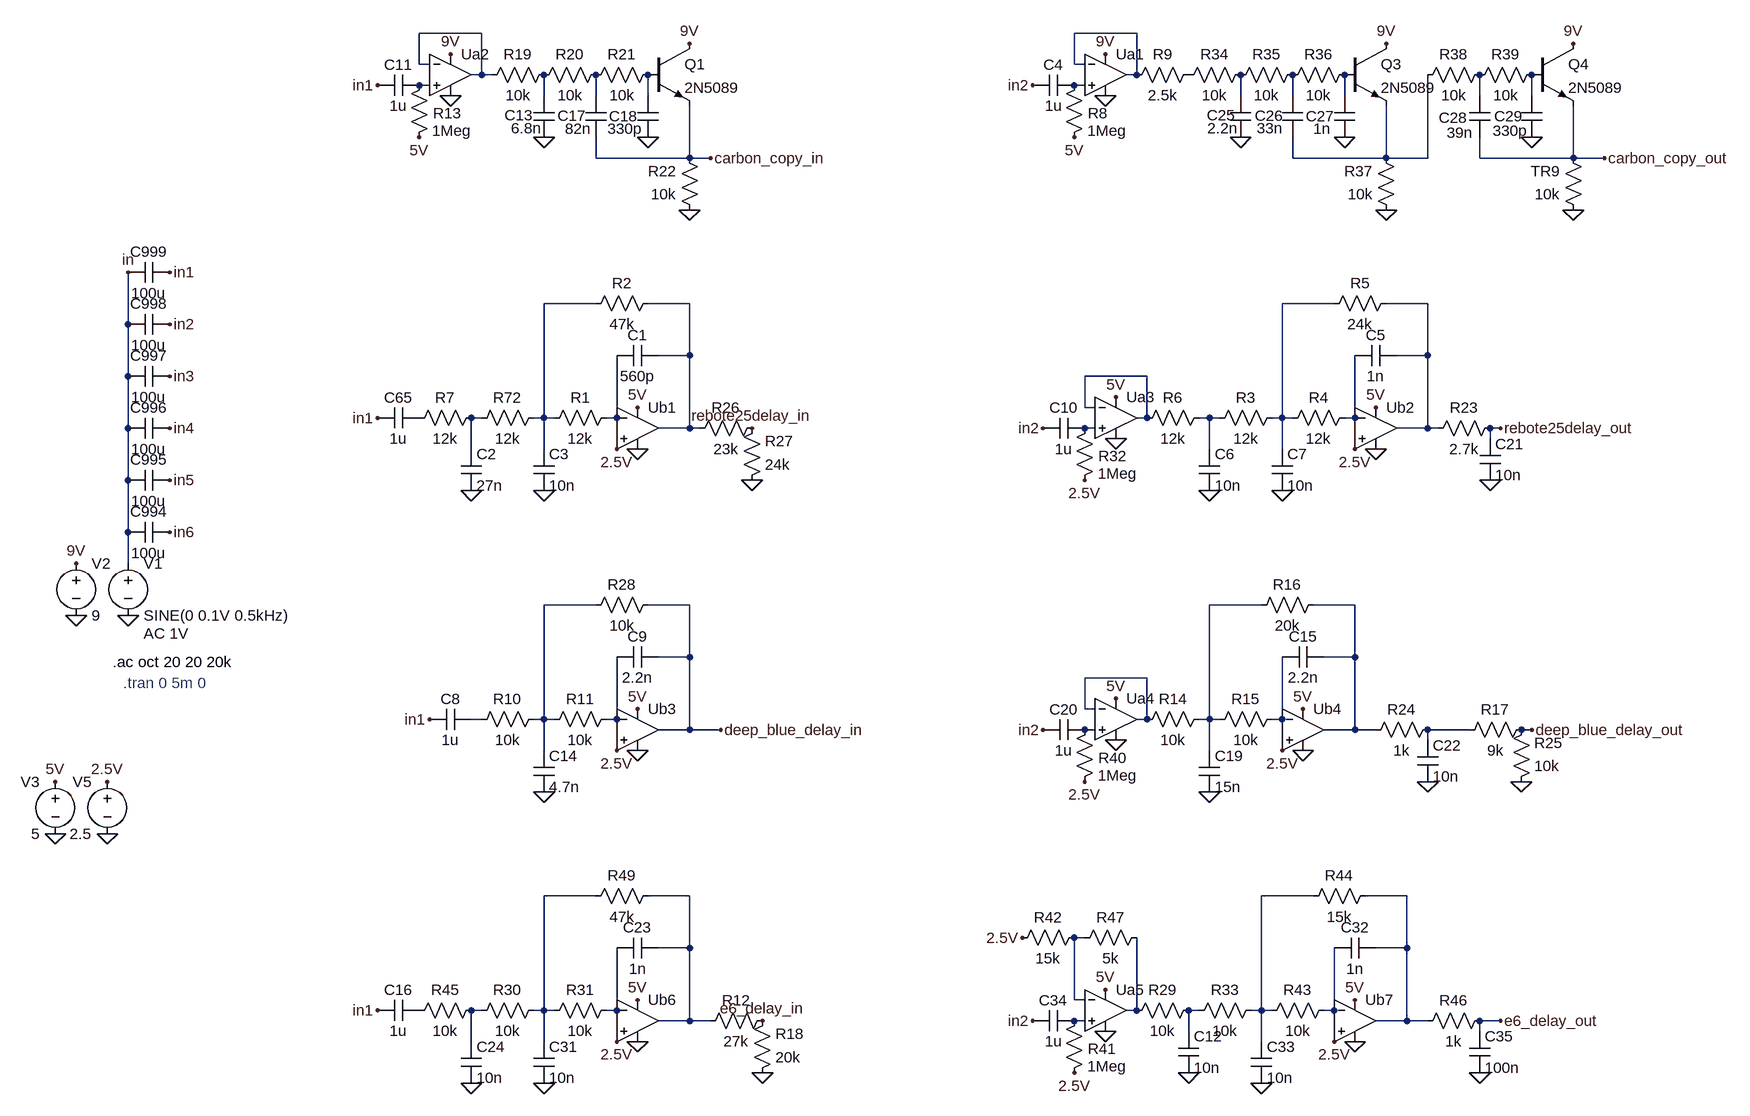
[diagram p0: schematic PT2399_LPF.asc]
PT2399_LPF.asc, the LTspice schematic file:
Version 4
SHEET 1 4500 3732
WIRE -240 272 -336 272
WIRE 768 272 672 272
WIRE -336 320 -336 272
WIRE -320 320 -336 320
WIRE 672 320 672 272
WIRE 688 320 672 320
WIRE -240 336 -240 272
WIRE -240 336 -256 336
WIRE -224 336 -240 336
WIRE 768 336 768 272
WIRE 768 336 752 336
WIRE -320 352 -336 352
WIRE 688 352 672 352
WIRE -144 368 -144 336
WIRE -64 368 -64 336
WIRE 16 368 16 336
WIRE 928 368 928 336
WIRE 1008 368 1008 336
WIRE 1088 368 1088 336
WIRE 1296 368 1296 336
WIRE 1376 368 1376 336
WIRE -64 464 -64 432
WIRE 80 464 80 384
WIRE 80 464 -64 464
WIRE 112 464 80 464
WIRE 1008 464 1008 432
WIRE 1152 464 1152 384
WIRE 1152 464 1008 464
WIRE 1216 464 1216 336
WIRE 1216 464 1152 464
WIRE 1296 464 1296 432
WIRE 1440 464 1440 384
WIRE 1440 464 1296 464
WIRE 1488 464 1440 464
WIRE -64 688 -144 688
WIRE 80 688 16 688
WIRE 1072 688 992 688
WIRE 1216 688 1152 688
WIRE -784 720 -784 640
WIRE 80 768 80 688
WIRE 80 768 32 768
WIRE 1216 768 1216 688
WIRE 1216 768 1168 768
WIRE -784 800 -784 720
WIRE 784 800 688 800
WIRE 688 848 688 800
WIRE 704 848 688 848
WIRE -240 864 -256 864
WIRE -144 864 -144 688
WIRE -144 864 -160 864
WIRE -128 864 -144 864
WIRE -32 864 -32 768
WIRE -32 864 -48 864
WIRE 784 864 784 800
WIRE 784 864 768 864
WIRE 880 864 864 864
WIRE 896 864 880 864
WIRE 992 864 992 688
WIRE 992 864 976 864
WIRE 1008 864 992 864
WIRE 1104 864 1104 768
WIRE 1104 864 1088 864
WIRE -784 880 -784 800
WIRE 80 880 80 768
WIRE 80 880 32 880
WIRE 96 880 80 880
WIRE 704 880 688 880
WIRE 1216 880 1216 768
WIRE 1216 880 1168 880
WIRE 1232 880 1216 880
WIRE 1328 880 1312 880
WIRE 1312 896 1312 880
WIRE -256 912 -256 864
WIRE -144 912 -144 864
WIRE -32 912 -32 896
WIRE 880 912 880 864
WIRE 992 912 992 864
WIRE 1104 912 1104 896
WIRE -784 960 -784 880
WIRE -784 1040 -784 960
WIRE -784 1088 -784 1040
WIRE -64 1152 -144 1152
WIRE 80 1152 16 1152
WIRE 960 1152 880 1152
WIRE 1104 1152 1040 1152
WIRE 80 1232 80 1152
WIRE 80 1232 32 1232
WIRE 1104 1232 1104 1152
WIRE 1104 1232 1056 1232
WIRE 784 1264 688 1264
WIRE 688 1312 688 1264
WIRE 704 1312 688 1312
WIRE -240 1328 -256 1328
WIRE -144 1328 -144 1152
WIRE -144 1328 -160 1328
WIRE -128 1328 -144 1328
WIRE -32 1328 -32 1232
WIRE -32 1328 -48 1328
WIRE 784 1328 784 1264
WIRE 784 1328 768 1328
WIRE 880 1328 880 1152
WIRE 880 1328 864 1328
WIRE 896 1328 880 1328
WIRE 992 1328 992 1232
WIRE 992 1328 976 1328
WIRE 80 1344 80 1232
WIRE 80 1344 32 1344
WIRE 128 1344 80 1344
WIRE 704 1344 688 1344
WIRE 1104 1344 1104 1232
WIRE 1104 1344 1056 1344
WIRE 1136 1344 1104 1344
WIRE 1280 1344 1216 1344
WIRE 1376 1344 1360 1344
WIRE 1216 1360 1216 1344
WIRE -144 1376 -144 1328
WIRE -32 1376 -32 1360
WIRE 880 1376 880 1328
WIRE 992 1376 992 1360
WIRE -64 1600 -144 1600
WIRE 80 1600 16 1600
WIRE 1040 1600 960 1600
WIRE 1184 1600 1120 1600
WIRE 688 1664 672 1664
WIRE 80 1680 80 1600
WIRE 80 1680 32 1680
WIRE 1184 1680 1184 1600
WIRE 1184 1680 1136 1680
WIRE 672 1760 672 1664
WIRE 688 1760 672 1760
WIRE -240 1776 -256 1776
WIRE -144 1776 -144 1600
WIRE -144 1776 -160 1776
WIRE -128 1776 -144 1776
WIRE -32 1776 -32 1680
WIRE -32 1776 -48 1776
WIRE 768 1776 768 1664
WIRE 768 1776 752 1776
WIRE 864 1776 848 1776
WIRE 960 1776 960 1600
WIRE 960 1776 944 1776
WIRE 976 1776 960 1776
WIRE 1072 1776 1072 1680
WIRE 1072 1776 1056 1776
WIRE 80 1792 80 1680
WIRE 80 1792 32 1792
WIRE 112 1792 80 1792
WIRE 688 1792 672 1792
WIRE 1184 1792 1184 1680
WIRE 1184 1792 1136 1792
WIRE 1216 1792 1184 1792
WIRE 1328 1792 1296 1792
WIRE 848 1808 848 1776
WIRE 1296 1808 1296 1792
WIRE -256 1824 -256 1776
WIRE -144 1824 -144 1776
WIRE -32 1824 -32 1808
WIRE 960 1824 960 1776
WIRE 1072 1824 1072 1808
FLAG -784 1168 0
FLAG -784 640 in
FLAG -864 1168 0
FLAG -864 1088 9V
FLAG -720 640 in1
FLAG -720 720 in2
FLAG -720 800 in3
FLAG -720 880 in4
FLAG -720 960 in5
FLAG -720 1040 in6
FLAG -400 864 in1
FLAG -816 1424 2.5V
FLAG -896 1504 0
FLAG -896 1424 5V
FLAG 0 848 5V
FLAG 0 912 0
FLAG -32 912 2.5V
FLAG -144 976 0
FLAG -256 976 0
FLAG 176 880 rebote25delay_in
FLAG 1136 848 5V
FLAG 1136 912 0
FLAG 1104 912 2.5V
FLAG 992 976 0
FLAG 880 976 0
FLAG 1152 288 9V
FLAG 1088 432 0
FLAG 928 432 0
FLAG 1152 544 0
FLAG 1440 288 9V
FLAG 1376 432 0
FLAG 1440 544 0
FLAG 1488 464 carbon_copy_out
FLAG -400 352 in1
FLAG 80 288 9V
FLAG 16 432 0
FLAG -144 432 0
FLAG 80 544 0
FLAG 112 464 carbon_copy_in
FLAG -288 304 9V
FLAG -288 368 0
FLAG -336 432 5V
FLAG 608 352 in2
FLAG 720 304 9V
FLAG 720 368 0
FLAG 672 432 5V
FLAG -320 1328 in1
FLAG 0 1312 5V
FLAG 0 1376 0
FLAG -32 1376 2.5V
FLAG -144 1440 0
FLAG 128 1344 deep_blue_delay_in
FLAG 1024 1312 5V
FLAG 1024 1376 0
FLAG 992 1376 2.5V
FLAG 880 1440 0
FLAG 1312 960 0
FLAG 1216 1424 0
FLAG 176 960 0
FLAG -400 1776 in1
FLAG 0 1760 5V
FLAG 0 1824 0
FLAG -32 1824 2.5V
FLAG -144 1888 0
FLAG -256 1888 0
FLAG 192 1792 e6_delay_in
FLAG 1104 1760 5V
FLAG 1104 1824 0
FLAG 1072 1824 2.5V
FLAG 960 1888 0
FLAG 1296 1872 0
FLAG 192 1872 0
FLAG 848 1872 0
FLAG -816 1504 0
FLAG 1328 880 rebote25delay_out
FLAG 1376 1344 deep_blue_delay_out
FLAG 1328 1792 e6_delay_out
FLAG 624 880 in2
FLAG 736 896 0
FLAG 736 832 5V
FLAG 688 960 2.5V
FLAG 624 1344 in2
FLAG 736 1360 0
FLAG 736 1296 5V
FLAG 688 1424 2.5V
FLAG 608 1792 in2
FLAG 720 1808 0
FLAG 720 1744 5V
FLAG 672 1872 2.5V
FLAG 1360 1424 0
FLAG 592 1664 2.5V
SYMBOL voltage -784 1072 R0
WINDOW 123 24 124 Left 2
WINDOW 39 0 0 Left 2
SYMATTR Value2 AC 1V
SYMATTR InstName V1
SYMATTR Value SINE(0 0.1V 0.5kHz)
SYMBOL voltage -864 1072 R0
WINDOW 123 0 0 Left 0
WINDOW 39 0 0 Left 0
SYMATTR InstName V2
SYMATTR Value 9
SYMBOL cap -720 704 R90
WINDOW 0 0 32 VBottom 2
WINDOW 3 32 32 VTop 2
SYMATTR InstName C998
SYMATTR Value 100u
SYMBOL cap -720 784 R90
WINDOW 0 0 32 VBottom 2
WINDOW 3 32 32 VTop 2
SYMATTR InstName C997
SYMATTR Value 100u
SYMBOL cap -720 864 R90
WINDOW 0 0 32 VBottom 2
WINDOW 3 32 32 VTop 2
SYMATTR InstName C996
SYMATTR Value 100u
SYMBOL cap -720 624 R90
WINDOW 0 0 32 VBottom 2
WINDOW 3 32 32 VTop 2
SYMATTR InstName C999
SYMATTR Value 100u
SYMBOL cap -720 944 R90
WINDOW 0 0 32 VBottom 2
WINDOW 3 32 32 VTop 2
SYMATTR InstName C995
SYMATTR Value 100u
SYMBOL cap -720 1024 R90
WINDOW 0 0 32 VBottom 2
WINDOW 3 32 32 VTop 2
SYMATTR InstName C994
SYMATTR Value 100u
SYMBOL cap -336 848 R90
WINDOW 0 0 32 VBottom 2
WINDOW 3 32 32 VTop 2
SYMATTR InstName C65
SYMATTR Value 1u
SYMBOL voltage -896 1408 M0
WINDOW 123 0 0 Left 0
WINDOW 39 0 0 Left 0
SYMATTR InstName V3
SYMATTR Value 5
SYMBOL res -144 848 R90
WINDOW 0 0 56 VBottom 2
WINDOW 3 32 56 VTop 2
SYMATTR InstName R72
SYMATTR Value 12k
SYMBOL res -32 848 R90
WINDOW 0 0 56 VBottom 2
WINDOW 3 32 56 VTop 2
SYMATTR InstName R1
SYMATTR Value 12k
SYMBOL Opamps\\UniversalOpamp2 0 880 R0
SYMATTR InstName Ub1
SYMBOL res 32 672 R90
WINDOW 0 0 56 VBottom 2
WINDOW 3 32 56 VTop 2
SYMATTR InstName R2
SYMATTR Value 47k
SYMBOL cap 32 752 R90
WINDOW 0 0 32 VBottom 2
WINDOW 3 32 32 VTop 2
SYMATTR InstName C1
SYMATTR Value 560p
SYMBOL cap -272 976 M180
WINDOW 0 24 56 Left 2
WINDOW 3 24 8 Left 2
SYMATTR InstName C2
SYMATTR Value 27n
SYMBOL cap -160 976 M180
WINDOW 0 24 56 Left 2
WINDOW 3 24 8 Left 2
SYMATTR InstName C3
SYMATTR Value 10n
SYMBOL res 992 848 R90
WINDOW 0 0 56 VBottom 2
WINDOW 3 32 56 VTop 2
SYMATTR InstName R3
SYMATTR Value 12k
SYMBOL res 1104 848 R90
WINDOW 0 0 56 VBottom 2
WINDOW 3 32 56 VTop 2
SYMATTR InstName R4
SYMATTR Value 12k
SYMBOL Opamps\\UniversalOpamp2 1136 880 R0
SYMATTR InstName Ub2
SYMBOL res 1168 672 R90
WINDOW 0 0 56 VBottom 2
WINDOW 3 32 56 VTop 2
SYMATTR InstName R5
SYMATTR Value 24k
SYMBOL cap 1168 752 R90
WINDOW 0 0 32 VBottom 2
WINDOW 3 32 32 VTop 2
SYMATTR InstName C5
SYMATTR Value 1n
SYMBOL cap 864 976 M180
WINDOW 0 24 56 Left 2
WINDOW 3 24 8 Left 2
SYMATTR InstName C6
SYMATTR Value 10n
SYMBOL cap 976 976 M180
WINDOW 0 24 56 Left 2
WINDOW 3 24 8 Left 2
SYMATTR InstName C7
SYMATTR Value 10n
SYMBOL res 880 848 R90
WINDOW 0 0 56 VBottom 2
WINDOW 3 32 56 VTop 2
SYMATTR InstName R6
SYMATTR Value 12k
SYMBOL res -240 848 R90
WINDOW 0 0 56 VBottom 2
WINDOW 3 32 56 VTop 2
SYMATTR InstName R7
SYMATTR Value 12k
SYMBOL res 944 320 R90
WINDOW 0 0 56 VBottom 2
WINDOW 3 32 56 VTop 2
SYMATTR InstName R34
SYMATTR Value 10k
SYMBOL cap 912 432 M180
WINDOW 0 -36 34 Left 2
WINDOW 3 -35 14 Left 2
SYMATTR InstName C25
SYMATTR Value 2.2n
SYMBOL res 1024 320 R90
WINDOW 0 0 56 VBottom 2
WINDOW 3 32 56 VTop 2
SYMATTR InstName R35
SYMATTR Value 10k
SYMBOL cap 992 432 M180
WINDOW 0 -42 33 Left 2
WINDOW 3 -39 14 Left 2
SYMATTR InstName C26
SYMATTR Value 33n
SYMBOL res 1104 320 R90
WINDOW 0 0 56 VBottom 2
WINDOW 3 32 56 VTop 2
SYMATTR InstName R36
SYMATTR Value 10k
SYMBOL cap 1072 432 M180
WINDOW 0 -44 32 Left 2
WINDOW 3 -32 13 Left 2
SYMATTR InstName C27
SYMATTR Value 1n
SYMBOL npn 1088 288 R0
SYMATTR InstName Q3
SYMATTR Value 2N5089
SYMBOL res 1168 560 R180
WINDOW 0 36 76 Left 2
WINDOW 3 36 40 Left 2
SYMATTR InstName R37
SYMATTR Value 10k
SYMBOL res 1312 320 R90
WINDOW 0 0 56 VBottom 2
WINDOW 3 32 56 VTop 2
SYMATTR InstName R38
SYMATTR Value 10k
SYMBOL cap 1280 432 M180
WINDOW 0 -47 30 Left 2
WINDOW 3 -35 7 Left 2
SYMATTR InstName C28
SYMATTR Value 39n
SYMBOL res 1392 320 R90
WINDOW 0 0 56 VBottom 2
WINDOW 3 32 56 VTop 2
SYMATTR InstName R39
SYMATTR Value 10k
SYMBOL cap 1360 432 M180
WINDOW 0 -42 32 Left 2
WINDOW 3 -44 10 Left 2
SYMATTR InstName C29
SYMATTR Value 330p
SYMBOL npn 1376 288 R0
SYMATTR InstName Q4
SYMATTR Value 2N5089
SYMBOL res 1456 560 R180
WINDOW 0 36 76 Left 2
WINDOW 3 36 40 Left 2
SYMATTR InstName TR9
SYMATTR Value 10k
SYMBOL cap -336 336 R90
WINDOW 0 0 32 VBottom 2
WINDOW 3 32 32 VTop 2
SYMATTR InstName C11
SYMATTR Value 1u
SYMBOL res -128 320 R90
WINDOW 0 0 56 VBottom 2
WINDOW 3 32 56 VTop 2
SYMATTR InstName R19
SYMATTR Value 10k
SYMBOL cap -160 432 M180
WINDOW 0 -45 34 Left 2
WINDOW 3 -35 14 Left 2
SYMATTR InstName C13
SYMATTR Value 6.8n
SYMBOL res -48 320 R90
WINDOW 0 0 56 VBottom 2
WINDOW 3 32 56 VTop 2
SYMATTR InstName R20
SYMATTR Value 10k
SYMBOL cap -80 432 M180
WINDOW 0 -43 33 Left 2
WINDOW 3 -32 13 Left 2
SYMATTR InstName C17
SYMATTR Value 82n
SYMBOL res 32 320 R90
WINDOW 0 0 56 VBottom 2
WINDOW 3 32 56 VTop 2
SYMATTR InstName R21
SYMATTR Value 10k
SYMBOL cap 0 432 M180
WINDOW 0 -44 32 Left 2
WINDOW 3 -46 13 Left 2
SYMATTR InstName C18
SYMATTR Value 330p
SYMBOL npn 16 288 R0
SYMATTR InstName Q1
SYMATTR Value 2N5089
SYMBOL res 96 560 R180
WINDOW 0 36 76 Left 2
WINDOW 3 36 40 Left 2
SYMATTR InstName R22
SYMATTR Value 10k
SYMBOL Opamps\\UniversalOpamp2 -288 336 R0
SYMATTR InstName Ua2
SYMBOL res -352 448 M180
WINDOW 0 37 53 Left 2
WINDOW 3 36 26 Left 2
SYMATTR InstName R13
SYMATTR Value 1Meg
SYMBOL cap 672 336 R90
WINDOW 0 0 32 VBottom 2
WINDOW 3 32 32 VTop 2
SYMATTR InstName C4
SYMATTR Value 1u
SYMBOL Opamps\\UniversalOpamp2 720 336 R0
SYMATTR InstName Ua1
SYMBOL res 656 448 M180
WINDOW 0 37 53 Left 2
WINDOW 3 36 26 Left 2
SYMATTR InstName R8
SYMATTR Value 1Meg
SYMBOL res 864 320 R90
WINDOW 0 0 56 VBottom 2
WINDOW 3 32 56 VTop 2
SYMATTR InstName R9
SYMATTR Value 2.5k
SYMBOL cap -256 1312 R90
WINDOW 0 0 32 VBottom 2
WINDOW 3 32 32 VTop 2
SYMATTR InstName C8
SYMATTR Value 1u
SYMBOL res -144 1312 R90
WINDOW 0 0 56 VBottom 2
WINDOW 3 32 56 VTop 2
SYMATTR InstName R10
SYMATTR Value 10k
SYMBOL res -32 1312 R90
WINDOW 0 0 56 VBottom 2
WINDOW 3 32 56 VTop 2
SYMATTR InstName R11
SYMATTR Value 10k
SYMBOL Opamps\\UniversalOpamp2 0 1344 R0
SYMATTR InstName Ub3
SYMBOL cap 32 1216 R90
WINDOW 0 0 32 VBottom 2
WINDOW 3 32 32 VTop 2
SYMATTR InstName C9
SYMATTR Value 2.2n
SYMBOL cap -160 1440 M180
WINDOW 0 24 56 Left 2
WINDOW 3 24 8 Left 2
SYMATTR InstName C14
SYMATTR Value 4.7n
SYMBOL res 880 1312 R90
WINDOW 0 0 56 VBottom 2
WINDOW 3 32 56 VTop 2
SYMATTR InstName R14
SYMATTR Value 10k
SYMBOL res 992 1312 R90
WINDOW 0 0 56 VBottom 2
WINDOW 3 32 56 VTop 2
SYMATTR InstName R15
SYMATTR Value 10k
SYMBOL Opamps\\UniversalOpamp2 1024 1344 R0
SYMATTR InstName Ub4
SYMBOL res 1056 1136 R90
WINDOW 0 0 56 VBottom 2
WINDOW 3 32 56 VTop 2
SYMATTR InstName R16
SYMATTR Value 20k
SYMBOL cap 1056 1216 R90
WINDOW 0 0 32 VBottom 2
WINDOW 3 32 32 VTop 2
SYMATTR InstName C15
SYMATTR Value 2.2n
SYMBOL cap 864 1440 M180
WINDOW 0 24 56 Left 2
WINDOW 3 24 8 Left 2
SYMATTR InstName C19
SYMATTR Value 15n
SYMBOL res 1328 864 R90
WINDOW 0 0 56 VBottom 2
WINDOW 3 32 56 VTop 2
SYMATTR InstName R23
SYMATTR Value 2.7k
SYMBOL cap 1296 960 M180
WINDOW 0 24 56 Left 2
WINDOW 3 24 8 Left 2
SYMATTR InstName C21
SYMATTR Value 10n
SYMBOL res 1232 1328 R90
WINDOW 0 0 56 VBottom 2
WINDOW 3 32 56 VTop 2
SYMATTR InstName R24
SYMATTR Value 1k
SYMBOL cap 1200 1424 M180
WINDOW 0 24 56 Left 2
WINDOW 3 24 8 Left 2
SYMATTR InstName C22
SYMATTR Value 10n
SYMBOL res 192 864 R90
WINDOW 0 0 56 VBottom 2
WINDOW 3 32 56 VTop 2
SYMATTR InstName R26
SYMATTR Value 23k
SYMBOL res 160 976 M180
WINDOW 0 36 76 Left 2
WINDOW 3 36 40 Left 2
SYMATTR InstName R27
SYMATTR Value 24k
SYMBOL res 32 1136 R90
WINDOW 0 0 56 VBottom 2
WINDOW 3 32 56 VTop 2
SYMATTR InstName R28
SYMATTR Value 10k
SYMBOL cap -336 1760 R90
WINDOW 0 0 32 VBottom 2
WINDOW 3 32 32 VTop 2
SYMATTR InstName C16
SYMATTR Value 1u
SYMBOL res -144 1760 R90
WINDOW 0 0 56 VBottom 2
WINDOW 3 32 56 VTop 2
SYMATTR InstName R30
SYMATTR Value 10k
SYMBOL res -32 1760 R90
WINDOW 0 0 56 VBottom 2
WINDOW 3 32 56 VTop 2
SYMATTR InstName R31
SYMATTR Value 10k
SYMBOL Opamps\\UniversalOpamp2 0 1792 R0
SYMATTR InstName Ub6
SYMBOL cap 32 1664 R90
WINDOW 0 0 32 VBottom 2
WINDOW 3 32 32 VTop 2
SYMATTR InstName C23
SYMATTR Value 1n
SYMBOL cap -272 1888 M180
WINDOW 0 24 56 Left 2
WINDOW 3 24 8 Left 2
SYMATTR InstName C24
SYMATTR Value 10n
SYMBOL cap -160 1888 M180
WINDOW 0 24 56 Left 2
WINDOW 3 24 8 Left 2
SYMATTR InstName C31
SYMATTR Value 10n
SYMBOL res 960 1760 R90
WINDOW 0 0 56 VBottom 2
WINDOW 3 32 56 VTop 2
SYMATTR InstName R33
SYMATTR Value 10k
SYMBOL res 1072 1760 R90
WINDOW 0 0 56 VBottom 2
WINDOW 3 32 56 VTop 2
SYMATTR InstName R43
SYMATTR Value 10k
SYMBOL Opamps\\UniversalOpamp2 1104 1792 R0
SYMATTR InstName Ub7
SYMBOL res 1136 1584 R90
WINDOW 0 0 56 VBottom 2
WINDOW 3 32 56 VTop 2
SYMATTR InstName R44
SYMATTR Value 15k
SYMBOL cap 1136 1664 R90
WINDOW 0 0 32 VBottom 2
WINDOW 3 32 32 VTop 2
SYMATTR InstName C32
SYMATTR Value 1n
SYMBOL cap 944 1888 M180
WINDOW 0 24 56 Left 2
WINDOW 3 24 8 Left 2
SYMATTR InstName C33
SYMATTR Value 10n
SYMBOL res -240 1760 R90
WINDOW 0 0 56 VBottom 2
WINDOW 3 32 56 VTop 2
SYMATTR InstName R45
SYMATTR Value 10k
SYMBOL res 1312 1776 R90
WINDOW 0 0 56 VBottom 2
WINDOW 3 32 56 VTop 2
SYMATTR InstName R46
SYMATTR Value 1k
SYMBOL cap 1280 1872 M180
WINDOW 0 24 56 Left 2
WINDOW 3 24 8 Left 2
SYMATTR InstName C35
SYMATTR Value 100n
SYMBOL res 32 1584 R90
WINDOW 0 0 56 VBottom 2
WINDOW 3 32 56 VTop 2
SYMATTR InstName R49
SYMATTR Value 47k
SYMBOL res 208 1776 R90
WINDOW 0 0 56 VBottom 2
WINDOW 3 32 56 VTop 2
SYMATTR InstName R12
SYMATTR Value 27k
SYMBOL res 176 1888 M180
WINDOW 0 36 76 Left 2
WINDOW 3 36 40 Left 2
SYMATTR InstName R18
SYMATTR Value 20k
SYMBOL res 864 1760 R90
WINDOW 0 0 56 VBottom 2
WINDOW 3 32 56 VTop 2
SYMATTR InstName R29
SYMATTR Value 10k
SYMBOL cap 832 1872 M180
WINDOW 0 24 56 Left 2
WINDOW 3 24 8 Left 2
SYMATTR InstName C12
SYMATTR Value 10n
SYMBOL voltage -816 1408 M0
WINDOW 123 0 0 Left 0
WINDOW 39 0 0 Left 0
SYMATTR InstName V5
SYMATTR Value 2.5
SYMBOL cap 688 864 R90
WINDOW 0 0 32 VBottom 2
WINDOW 3 32 32 VTop 2
SYMATTR InstName C10
SYMATTR Value 1u
SYMBOL Opamps\\UniversalOpamp2 736 864 R0
SYMATTR InstName Ua3
SYMBOL res 672 976 M180
WINDOW 0 37 53 Left 2
WINDOW 3 36 26 Left 2
SYMATTR InstName R32
SYMATTR Value 1Meg
SYMBOL cap 688 1328 R90
WINDOW 0 0 32 VBottom 2
WINDOW 3 32 32 VTop 2
SYMATTR InstName C20
SYMATTR Value 1u
SYMBOL Opamps\\UniversalOpamp2 736 1328 R0
SYMATTR InstName Ua4
SYMBOL res 672 1440 M180
WINDOW 0 37 53 Left 2
WINDOW 3 36 26 Left 2
SYMATTR InstName R40
SYMATTR Value 1Meg
SYMBOL cap 672 1776 R90
WINDOW 0 0 32 VBottom 2
WINDOW 3 32 32 VTop 2
SYMATTR InstName C34
SYMATTR Value 1u
SYMBOL Opamps\\UniversalOpamp2 720 1776 R0
SYMATTR InstName Ua5
SYMBOL res 656 1888 M180
WINDOW 0 37 53 Left 2
WINDOW 3 36 26 Left 2
SYMATTR InstName R41
SYMATTR Value 1Meg
SYMBOL res 1376 1328 R90
WINDOW 0 0 56 VBottom 2
WINDOW 3 32 56 VTop 2
SYMATTR InstName R17
SYMATTR Value 9k
SYMBOL res 1344 1440 M180
WINDOW 0 36 76 Left 2
WINDOW 3 36 40 Left 2
SYMATTR InstName R25
SYMATTR Value 10k
SYMBOL res 688 1648 R90
WINDOW 0 0 56 VBottom 2
WINDOW 3 32 56 VTop 2
SYMATTR InstName R42
SYMATTR Value 15k
SYMBOL res 784 1648 R90
WINDOW 0 0 56 VBottom 2
WINDOW 3 32 56 VTop 2
SYMATTR InstName R47
SYMATTR Value 5k
TEXT -808 1240 Left 2 !.ac oct 20 20 20k
TEXT -792 1272 Left 2 ;.tran 0 5m 0

The netlist it stands for:
* PT2399_LPF.asc
V1 in 0 SINE(0 0.1V 0.5kHz) AC 1V
V2 9V 0 9
C998 in2 in 100u
C997 in3 in 100u
C996 in4 in 100u
C999 in1 in 100u
C995 in5 in 100u
C994 in6 in 100u
C65 P001 in1 1u
V3 5V 0 5
R72 N014 N019 12k
R1 N020 N014 12k
XUb1 2.5V N020 5V 0 N015 level.2 Avol=1Meg GBW=10Meg Slew=10Meg ilimit=25m rail=0 Vos=0 phimargin=45 en=0 enk=0 in=0 ink=0 Rin=500Meg  ; pins IN+ IN- V+ V- OUT
R2 N015 N014 47k
C1 N015 N020 560p
C2 0 N019 27n
C3 0 N014 10n
R3 N016 N021 12k
R4 N022 N016 12k
XUb2 2.5V N022 5V 0 N017 level.2 Avol=1Meg GBW=10Meg Slew=10Meg ilimit=25m rail=0 Vos=0 phimargin=45 en=0 enk=0 in=0 ink=0 Rin=500Meg  ; pins IN+ IN- V+ V- OUT
R5 N017 N016 24k
C5 N017 N022 1n
C6 0 N021 10n
C7 0 N016 10n
R6 N021 N018 12k
R7 N019 P001 12k
R34 N008 P002 10k
C25 0 N008 2.2n
R35 N009 N008 10k
C26 N013 N009 33n
R36 N010 N009 10k
C27 0 N010 1n
Q3 9V N010 N013 0 2N5089
R37 0 N013 10k
R38 N011 N013 10k
C28 carbon_copy_out N011 39n
R39 N012 N011 10k
C29 0 N012 330p
Q4 9V N012 carbon_copy_out 0 2N5089
R§TR9 0 carbon_copy_out 10k
C11 N003 in1 1u
R19 N005 N001 10k
C13 0 N005 6.8n
R20 N006 N005 10k
C17 carbon_copy_in N006 82n
R21 N007 N006 10k
C18 0 N007 330p
Q1 9V N007 carbon_copy_in 0 2N5089
R22 0 carbon_copy_in 10k
XUa2 N003 N001 9V 0 N001 level.2 Avol=1Meg GBW=10Meg Slew=10Meg ilimit=25m rail=0 Vos=0 phimargin=45 en=0 enk=0 in=0 ink=0 Rin=500Meg  ; pins IN+ IN- V+ V- OUT
R13 5V N003 1Meg
C4 N004 in2 1u
XUa1 N004 N002 9V 0 N002 level.2 Avol=1Meg GBW=10Meg Slew=10Meg ilimit=25m rail=0 Vos=0 phimargin=45 en=0 enk=0 in=0 ink=0 Rin=500Meg  ; pins IN+ IN- V+ V- OUT
R8 5V N004 1Meg
R9 P002 N002 2.5k
C8 N028 in1 1u
R10 N024 N028 10k
R11 N029 N024 10k
XUb3 2.5V N029 5V 0 deep_blue_delay_in level.2 Avol=1Meg GBW=10Meg Slew=10Meg ilimit=25m rail=0 Vos=0 phimargin=45 en=0 enk=0 in=0 ink=0 Rin=500Meg  ; pins IN+ IN- V+ V- OUT
C9 deep_blue_delay_in N029 2.2n
C14 0 N024 4.7n
R14 N025 N027 10k
R15 N030 N025 10k
XUb4 2.5V N030 5V 0 N026 level.2 Avol=1Meg GBW=10Meg Slew=10Meg ilimit=25m rail=0 Vos=0 phimargin=45 en=0 enk=0 in=0 ink=0 Rin=500Meg  ; pins IN+ IN- V+ V- OUT
R16 N026 N025 20k
C15 N026 N030 2.2n
C19 0 N025 15n
R23 rebote25delay_out N017 2.7k
C21 0 rebote25delay_out 10n
R24 N032 N026 1k
C22 0 N032 10n
R26 rebote25delay_in N015 23k
R27 0 rebote25delay_in 24k
R28 deep_blue_delay_in N024 10k
C16 P003 in1 1u
R30 N033 N038 10k
R31 N039 N033 10k
XUb6 2.5V N039 5V 0 N034 level.2 Avol=1Meg GBW=10Meg Slew=10Meg ilimit=25m rail=0 Vos=0 phimargin=45 en=0 enk=0 in=0 ink=0 Rin=500Meg  ; pins IN+ IN- V+ V- OUT
C23 N034 N039 1n
C24 0 N038 10n
C31 0 N033 10n
R33 N035 N041 10k
R43 N042 N035 10k
XUb7 2.5V N042 5V 0 N036 level.2 Avol=1Meg GBW=10Meg Slew=10Meg ilimit=25m rail=0 Vos=0 phimargin=45 en=0 enk=0 in=0 ink=0 Rin=500Meg  ; pins IN+ IN- V+ V- OUT
R44 N036 N035 15k
C32 N036 N042 1n
C33 0 N035 10n
R45 N038 P003 10k
R46 e6_delay_out N036 1k
C35 0 e6_delay_out 100n
R49 N034 N033 47k
R12 e6_delay_in N034 27k
R18 0 e6_delay_in 20k
R29 N041 N040 10k
C12 0 N041 10n
V5 2.5V 0 2.5
C10 N023 in2 1u
XUa3 N023 N018 5V 0 N018 level.2 Avol=1Meg GBW=10Meg Slew=10Meg ilimit=25m rail=0 Vos=0 phimargin=45 en=0 enk=0 in=0 ink=0 Rin=500Meg  ; pins IN+ IN- V+ V- OUT
R32 2.5V N023 1Meg
C20 N031 in2 1u
XUa4 N031 N027 5V 0 N027 level.2 Avol=1Meg GBW=10Meg Slew=10Meg ilimit=25m rail=0 Vos=0 phimargin=45 en=0 enk=0 in=0 ink=0 Rin=500Meg  ; pins IN+ IN- V+ V- OUT
R40 2.5V N031 1Meg
C34 N043 in2 1u
XUa5 N043 N037 5V 0 N040 level.2 Avol=1Meg GBW=10Meg Slew=10Meg ilimit=25m rail=0 Vos=0 phimargin=45 en=0 enk=0 in=0 ink=0 Rin=500Meg  ; pins IN+ IN- V+ V- OUT
R41 2.5V N043 1Meg
R17 deep_blue_delay_out N032 9k
R25 0 deep_blue_delay_out 10k
R42 N037 2.5V 15k
R47 N040 N037 5k
.model NPN NPN
.model PNP PNP
.lib standard.bjt
.ac oct 20 20 20k
* .tran 0 5m 0
.lib UniversalOpamps2.sub
.backanno
.end